# EasyEDA Pro project pcb_optica.epro

# Schematic Schematic2
Board Name: Board4; Create Date: 2026-04-02; Page Name: P1; Project Name: DPE25-26-2PCB; Schematic Name: Schematic2; Update Date: 2026-04-02; Company: EasyEDA.com; Page Size: A4; Version: V1.0
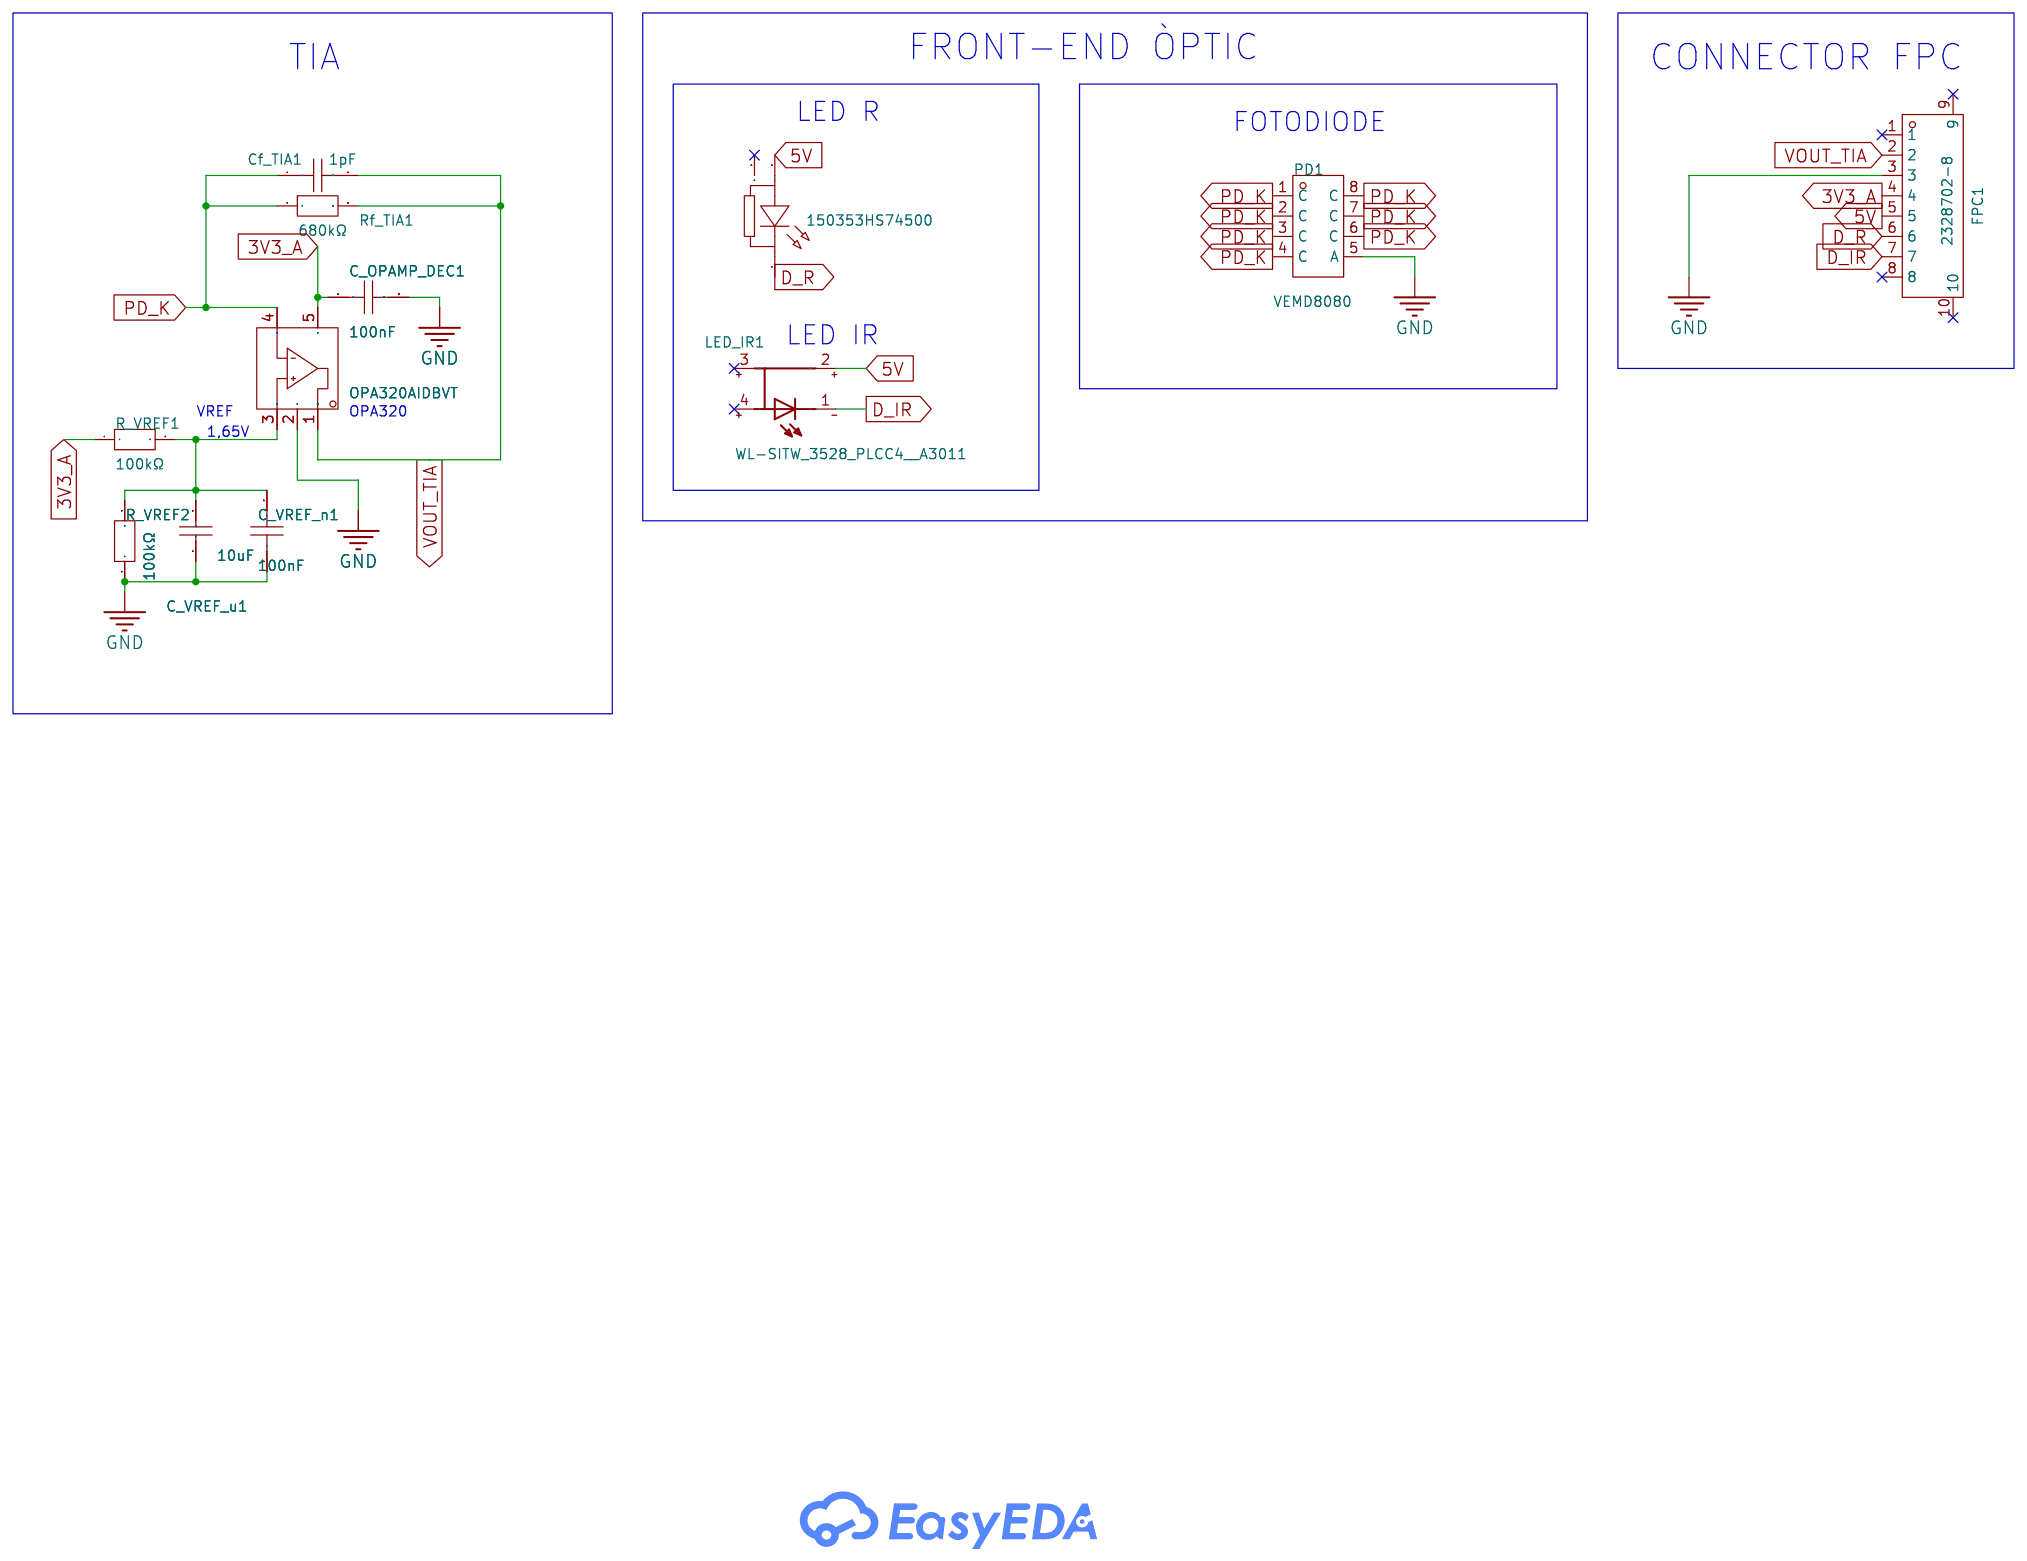
[diagram p0: schematic sheet]

## Parts
C_OPAMP_DEC1  100nF  [C0805]
C_VREF_n1  100nF  [C0805]
C_VREF_u1  10uF  [C0805]
Cf_TIA1  1pF  [C0805]
FPC1  2328702-8  [CONN-SMD_8P-P0.50-2328702-8]
LED_IR1  WL-SITW_3528_PLCC4__A3011  [WL-SITW_3528_PLCC4_A3011]
LED_R1  150353HS74500  [LED-SMD_3P-L3.4-W3.4_158353050]
PD1  VEMD8080  [SENSOR-SMD_8P-L4.8-W2.5-P1.31]
R_VREF1  100kΩ  [R0603]
R_VREF2  100kΩ  [R0603]
Rf_TIA1  680kΩ  [R0805]
U_TIA1  OPA320AIDBVT  [SOT-23-5_L2.9-W1.6-P0.95-LS2.8-BL]

## Library data of the parts
C_OPAMP_DEC1 C_VREF_n1 = C0805X104K101TB: Capacitance:100nF Tolerance:±10% Tolerance:±10% Voltage Rating:100V Temperature Coefficient:-; LCSC Part Name: 100nF ±10% 100V; Supplier Part: C495959; Manufacturer: IHHEC(禾伸堂); Supplier Footprint: 0805; JLCPCB Part Class: Extended Part; Datasheet: https://item.szlcsc.com/datasheet/C0805X104K101TB/507439.html; Supplier: LCSC; Tolerance: ±10%; Voltage Rating: 100V
C_VREF_u1 = 0805F106M100: Capacitance:10uF Tolerance:±20% Tolerance:±20% Voltage Rating:10V Temperature Coefficient:Y5V; LCSC Part Name: 停产 10uF ±20% 10V; Supplier Part: C105506; Manufacturer: Walsin(华新科); Supplier Footprint: 0805; JLCPCB Part Class: Extended Part; Datasheet: https://item.szlcsc.com/datasheet/0805F106M100/106721.html; Supplier: LCSC; Tolerance: ±20%; Voltage Rating: 10V; Temperature Coefficient: Y5V
Cf_TIA1 = CC0805BRNPO9BN1R0: Capacitance: Voltage Rated: Temperature Coefficient:; LCSC Part Name: 1pF 50V; Supplier Part: C519982; Manufacturer: YAGEO(国巨); Supplier Footprint: 0805; JLCPCB Part Class: Extended Part; Datasheet: https://atta.szlcsc.com/upload/public/pdf/source/20200423/C519982_66B2217469EF9B7E9C3721B43873BEC4.pdf; Supplier: LCSC
FPC1 = 2328702-8: Locking Feature:Hinged Lid Contact Type:Double-Sided Contacts, Top and Bottom Entry Number of Contacts:8P Pitch:0.5mm Mounting Type:Surface Mount, Right Angle FFC, FCB Thickness:0.3mm FFC, FCB Thickness:0.3mm Height Above Board:1.05mm Contact Material:Cop; LCSC Part Name: 翻盖式 双侧触点/上下接 P数:8P 间距:0.5mm; Supplier Part: C3168593; Manufacturer: TE Connectivity(泰科电子); Supplier Footprint: SMD,P=0.5mm,卧贴; JLCPCB Part Class: Extended Part; Datasheet: https://item.szlcsc.com/datasheet/2328702-8/3730530.html; Supplier: LCSC; Locking Feature: Hinged Lid; Contact Type: Double-Sided Contacts, Top and Bottom Entry; Number of Contacts: 8P; Pitch: 0.5mm; Mounting Type: Surface Mount, Right Angle; FFC, FCB Thickness: 0.3mm; Height Above Board: 1.05mm; Contact Material: Copper Alloy; Contact Plating: Gold; Operating Temperature: -40℃~+85℃; Rated Voltage (Max): 50V; Current Rating (Max): 500mA
LED_IR1 = WL-SITW_3528_PLCC4__A3011
LED_R1 = 150353HS74500: Illumination Color:- Voltage - Forward(Vf):2.4V Voltage - Forward(Vf):2.4V Forward Current:350mA Peak Wavelength:660nm Lens Color:Water Clear Viewing Angle:125°; Supplier Part: C6364991; Manufacturer: Wurth(伍尔特); Supplier Footprint: SMD-3P,3.4x3.4mm; JLCPCB Part Class: Extended Part; Datasheet: https://www.we-online.com/components/products/datasheet/150353HS74500.pdf; Supplier: LCSC; Voltage - Forward(Vf): 2.4V; Forward Current: 350mA; Peak Wavelength: 660nm; Lens Color: Water Clear; Viewing Angle: 125°
PD1 = VEMD8080: Voltage - DC Reverse(Vr):20V Viewing Angle:±65° Peak Wavelength:850nm Spectral Range:350nm~1100nm Spectral Range:350nm~1100nm Dark Current:200pA Operating Temperature:-40℃~+85℃ Operating Temperature:-40℃~+85℃; LCSC Part Name: 光敏感度增强型高速硅PIN光电二极管850nm 频谱范围350nm~1100nm 反向电压20V; Supplier Part: C511402; Manufacturer: VISHAY(威世); Supplier Footprint: SMD-8P,4.8x2.5mm; JLCPCB Part Class: Extended Part; Datasheet: https://item.szlcsc.com/datasheet/VEMD8080/525876.html; Supplier: LCSC; Voltage - DC Reverse(Vr): 20V; Viewing Angle: ±65°; Peak Wavelength: 850nm; Spectral Range: 350nm~1100nm; Dark Current: 200pA; Operating Temperature: -40℃~+85℃
R_VREF1 R_VREF2 = FRC0603F1003TS: Type:Thick Film Resistor Resistance:100kΩ Tolerance:±1% Tolerance:±1% Power(Watts):100mW Voltage-Supply(Max):75V Temperature Coefficient:±100ppm/℃ Temperature Coefficient:±100ppm/℃ Operating Temperature:-55℃~+155℃ Operating Temperature:-55℃~+155℃; LCSC Part Name: 100kΩ ±1% 100mW 厚膜电阻; Supplier Part: C2906980; Manufacturer: FOJAN(富捷); Supplier Footprint: 0603; JLCPCB Part Class: Extended Part; Supplier: LCSC; Type: Thick Film Resistor; Tolerance: ±1%; Power(Watts): 100mW; Voltage-Supply(Max): 75V; Temperature Coefficient: ±100ppm/℃; Operating Temperature: -55℃~+155℃
Rf_TIA1 = PTFR0805B680KN9: Type:Thin Film Resistor Resistance:680kΩ Tolerance:±0.1% Tolerance:±0.1% Power(Watts):125mW Voltage-Supply(Max):150V Temperature Coefficient:±10ppm/℃ Temperature Coefficient:±10ppm/℃ Operating Temperature:-55℃~+155℃ Operating Temperature:-55℃~+155℃; LCSC Part Name: 薄膜电阻 680kΩ ±0.1% 125mW; Supplier Part: C5382595; Manufacturer: RESI(开步睿思); Supplier Footprint: 0805; JLCPCB Part Class: Extended Part; Datasheet: https://item.szlcsc.com/datasheet/PTFR0805B680KN9/6255130.html; Supplier: LCSC; Type: Thin Film Resistor; Tolerance: ±0.1%; Power(Watts): 125mW; Voltage-Supply(Max): 150V; Temperature Coefficient: ±10ppm/℃; Operating Temperature: -55℃~+155℃
U_TIA1 = OPA320AIDBVT: Number of Channels:Single channel Gain Bandwidth Product:20MHz Ib - Input Bias Current:0.2pA Slew Rate:10V/us Output Current:65mA Output Type:- Rail to Rail:- Operating Temperature:-40℃~+125℃ Operating Temperature:-40℃~+125℃; Supplier Part: C206063; Manufacturer: TI(德州仪器); Supplier Footprint: SOT-23-5; JLCPCB Part Class: Extended Part; Datasheet: https://www.ti.com/cn/lit/gpn/opa320; Supplier: LCSC; Number of Channels: Single channel; Gain Bandwidth Product: 20MHz; Ib - Input Bias Current: 0.2pA; Slew Rate: 10V/us; Output Current: 65mA; Operating Temperature: -40℃~+125℃

## Nets
3V3_A: C_OPAMP_DEC1.1 FPC1.4 R_VREF1.1 U_TIA1.5(V+)
5V: FPC1.5 LED_IR1.2 LED_R1.2(+)
GND: C_OPAMP_DEC1.2 C_VREF_n1.1 C_VREF_u1.1 FPC1.3 PD1.5(A) R_VREF2.1 U_TIA1.2(V-)
D_IR: FPC1.7 LED_IR1.1
D_R: FPC1.6 LED_R1.1(-)
PD_K: Cf_TIA1.1 PD1.1(C) PD1.2(C) PD1.3(C) PD1.4(C) PD1.6(C) PD1.7(C) PD1.8(C) Rf_TIA1.1 U_TIA1.4(IN-)
VOUT_TIA: Cf_TIA1.2 FPC1.2 Rf_TIA1.2 U_TIA1.1(OUT)
$1N835: C_VREF_n1.2 C_VREF_u1.2 R_VREF1.2 R_VREF2.2 U_TIA1.3(IN+)

Not connected (* = marked no-connect by the designer): FPC1 1* 8* 9* 10*; LED_IR1 3* 4*; LED_R1 3*

## Notes on the sheet
- FRONT-END ÒPTIC
- TIA
- CONNECTOR FPC
- LED R
- FOTODIODE
- LED IR
- VREF
- OPA320
- 1,65V

# Board PCB14
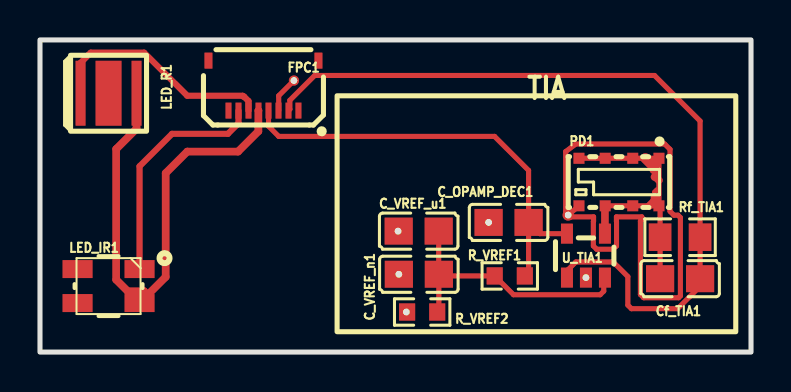
[diagram p1: board, top side]
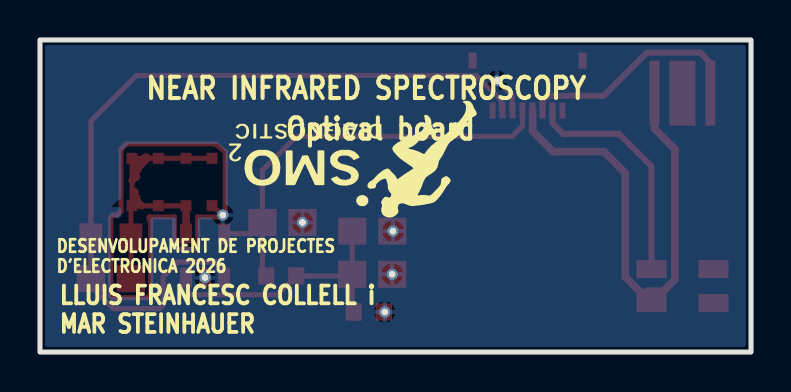
[diagram p2: board, bottom side, seen from below]

Outline 35.56 x 15.62 mm; copper layers: Top Layer, Bottom Layer. Coordinates in mm from the lower left corner of the outline.
Outline path: rectangle 0,15.62 35.56,0
Stack: Top Layer 0.035mm / Dielectric1 1.51mm FR4 er 4.5 / Bottom Layer 0.035mm

## Design rules (mm)
template: JLCPCB Capability(Two Layers Board)
spacing copperThickness1oz (default): track to track 0.102, other pairs 0.152 to 0.3
spacing copperThickness2oz: track to track 0.203, other pairs 0.152 to 0.3
track width copperThickness1oz (default): min 0.127, default 0.254, max 2.54
track width copperThickness2oz: min 0.203, default 0.254, max 2.54
differential pair differentialPair (default): width min 0.127, default 0.254, max 2.54; gap min 0.152, default 0.152
via viaSize (default): diameter min 0.5, default 0.61, max 10; hole min 0.3, default 0.305, max 6.3
pour e12 uses copperRegion

## Placement (name value [footprint] x y rotation side)
C_OPAMP_DEC1  100nF  [C0805]  23.44 6.49 180 top
C_VREF_n1  100nF  [C0805]  18.95 3.89 0 top
C_VREF_u1  10uF  [C0805]  18.94 6.05 0 top
Cf_TIA1  1pF  [C0805]  32.01 3.67 0 top
FPC1  2328702-8  [CONN-SMD_8P-P0.50-2328702-8]  11.18 13.33 180 top
LED_IR1  WL-SITW_3528_PLCC4__A3011  [WL-SITW_3528_PLCC4_A3011]  3.43 3.3 0 top
LED_R1  150353HS74500  [LED-SMD_3P-L3.4-W3.4_158353050]  3.43 12.95 0 top
NOREF  -  [Pad_e282]  22.44 6.49 0 top
NOREF#2  -  [Pad_e285]  18.32 2 0 top
NOREF#3  -  [Pad_e14]  26.42 6.86 0 top
NOREF#4  -  [Pad_e283]  17.91 6.05 0 top
NOREF#5  -  [Pad_e284]  17.95 3.89 0 top
NOREF#6  -  [Pad_e292]  12.7 13.59 0 top
NOREF#7  -  [Pad_e286]  27.31 3.73 0 top
PD1  VEMD8080  [SENSOR-SMD_8P-L4.8-W2.5-P1.31]  28.96 8.51 0 top
R_VREF1  100kΩ  [R0603]  23.5 3.81 180 top
R_VREF2  100kΩ  [R0603]  19.11 2 0 top
Rf_TIA1  680kΩ  [R0805]  32.01 5.75 0 top
U_TIA1  OPA320AIDBVT  [SOT-23-5_L2.9-W1.6-P0.95-LS2.8-BL]  27.31 4.83 0 top

## Footprints (pads in the part's own frame, mm; a bottom-side part is the same pattern mirrored in y, then rotated)
C0805
  rect 1.41x1.35 smd: 1(-1,0) 2(1,0)
CONN-SMD_8P-P0.50-2328702-8
  rect 0.3x0.8 smd: 1(-1.75,1.249) 2(-1.252,1.25) 3(-0.752,1.25) 4(-0.252,1.25) 5(0.248,1.25) 6(0.748,1.25) 7(1.248,1.25) 8(1.748,1.25)
  rect 0.4x0.8 smd: 9(-2.75,-1.25) 10(2.75,-1.25)
LED-SMD_3P-L3.4-W3.4_158353050
  rect 0.5x3.25 smd: 1(-1.4,0) 2(1.4,0)
  rect 1.3x3.25 smd: 3(0,0)
Pad_e14
  round 0.559 hole 0.336: 2(0,0)
Pad_e282
  round 0.559 hole 0.336: 2(0,0)
Pad_e283
  round 0.559 hole 0.336: 3(0,0)
Pad_e284
  round 0.559 hole 0.336: 4(0,0)
Pad_e285
  round 0.559 hole 0.336: 5(0,0)
Pad_e286
  round 0.559 hole 0.336: 6(0,0)
Pad_e292
  round 0.508 hole 0.336: 1(0,0)
R0603
  rect 0.806x0.864 smd: 1(-0.753,0) 2(0.753,0)
R0805
  rect 1.133x1.377 smd: 1(-1,0) 2(1,0)
SENSOR-SMD_8P-L4.8-W2.5-P1.31
  rect 0.55x0.55 smd: 1(2,1.19) 2(0.69,1.19) 3(-0.69,1.19) 4(-2,1.19) 5(-2,-1.19) 6(-0.69,-1.19) 7(0.69,-1.19) 8(2,-1.19)
SOT-23-5_L2.9-W1.6-P0.95-LS2.8-BL
  rect 0.6x1 smd: 1(-0.95,-1.1) 2(0,-1.1) 3(0.95,-1.1) 4(0.95,1.1) 5(-0.95,1.1)
WL-SITW_3528_PLCC4_A3011
  rect 1.5x0.9 smd: 1(1.55,0.85) 2(1.55,-0.85) 3(-1.55,-0.85) 4(-1.55,0.85)

## Nets
As in the schematic, except:
GND: C_OPAMP_DEC1.2 C_VREF_n1.1 C_VREF_u1.1 FPC1.3 NOREF.2 NOREF#2.5 NOREF#3.2 NOREF#4.3 NOREF#5.4 NOREF#6.1 NOREF#7.6 PD1.5 R_VREF2.1 U_TIA1.2

Pads without a net: FPC1 1 8 9 10; LED_IR1 3 4; LED_R1 3

## Routing (per net, layer and track width the routed paths; a pad name or vN(x,y) marks a point on that pad's centre or on a via; arc(x,y) is an arc through that point)
3V3_A: length 22.2
  Top Layer w0.254: 11.43,12.08 11.43,12.08 11.43,11.3 11.94,10.8 22.73,10.8 24.44,9.09 C_OPAMP_DEC1.1 ; U_TIA1.5 25,5.93 C_OPAMP_DEC1.1 ; C_OPAMP_DEC1.1 24.44,4 R_VREF1.1
5V: length 25.8
  Top Layer w0.254: LED_IR1.2 4.39,3.04
  Top Layer w0.381: LED_R1.2 4.83,11.18 3.81,10.16 3.81,3.62 4.39,3.04 5.2,3.04 5.21,3.05 ; 10.93,12.08 10.92,12.08 10.92,11.05 9.91,10.03 7.37,10.03 6.29,8.95 6.29,3.76 LED_IR1.2
GND: length 31.7
  Top Layer w0.254: 11.93,12.08 11.94,12.09 11.94,12.83 NOREF#6.1 ; PD1.5 26.45,6.88 ; 26.45,6.88 26.29,7.04 26.29,10.03 26.8,10.41 31.24,10.41 31.51,10.15 31.51,7.04 31.7,6.85 31.91,6.85 32.03,6.73 32.03,2.81 31.94,2.72 30.19,2.72 30.03,2.88 30.03,6.56 30.1,6.63 30.1,6.77 28.83,6.77 28.83,6.55 28.83,6.54 28.83,5.31 28.67,5.15 27.84,5.15 27.68,5.31 27.68,6.54 27.69,6.55 27.69,6.77 26.57,6.77 26.45,6.88 ; 26.45,6.88 NOREF#3.2
D_IR: length 11.6
  Top Layer w0.305: 9.93,12.08 9.93,11.45 9.4,10.92 6.6,10.92 4.98,9.3 LED_IR1.1
D_R: length 11.6
  Top Layer w0.305: 10.43,12.08 10.43,12.56 10.2,12.79 10.17,12.79 10.13,12.83 7.37,12.83 5.21,14.99 2.54,14.99 2.03,14.47 LED_R1.1
PD_K: length 15.9
  Top Layer w0.254: PD1.8 31.01,7.26 Rf_TIA1.1 Cf_TIA1.1 ; PD1.8 PD1.1 PD1.2 PD1.3 PD1.4 ; PD1.8 PD1.7 PD1.6 28.25,7.31 ; 30.73,8 30.86,8.13
  Top Layer w0.381: 30.73,8.76 30.79,8.76 30.96,8.59 ; 30.73,7.75 30.73,7.58 30.48,7.32 ; 28.25,7.31 U_TIA1.4
  Top Layer w0.508: 30.73,9.14 30.73,9.24 30.27,9.7
VOUT_TIA: length 40.3
  Top Layer w0.254: 12.43,12.08 12.5,12.15 12.5,12.6 13.74,13.84 30.73,13.84 33.01,11.56 Rf_TIA1.2 Cf_TIA1.2 33.08,3.61 33.08,3.35 31.89,2.17 29.58,2.17 29.4,2.35 29.4,3.78 28.67,4.51 26.8,4.51 26.42,4.13 26.42,3.79 U_TIA1.1
$1N835: length 13.5
  Top Layer w0.254: C_VREF_n1.2 19.94,3.9 C_VREF_u1.2 ; C_VREF_n1.2 20.03,3.81 R_VREF1.2 23.68,2.87 28.01,2.87 28.19,3.05 28.19,3.67 U_TIA1.3 ; C_VREF_n1.2 19.95,2.08 R_VREF2.2

## Copper pours and planes (outline as drawn; the poured copper is in the pictures)
GND on Bottom Layer: 0,15.62 35.56,15.62 35.56,0.17 0,0.17

## Text on the board
Bottom Silkscreen Layer: DESENVOLUPAMENT DE PROJECTES / D'ELECTRONICA 2026 | LLUIS FRANCESC COLLELL i / MAR STEINHAUER | Optical board | NEAR INFRARED SPECTROSCOPY
Top Silkscreen Layer: TIA
